# EAGLE design Pfeiffer_Compact_Gauge_Controller (EAGLE 8.5.2)
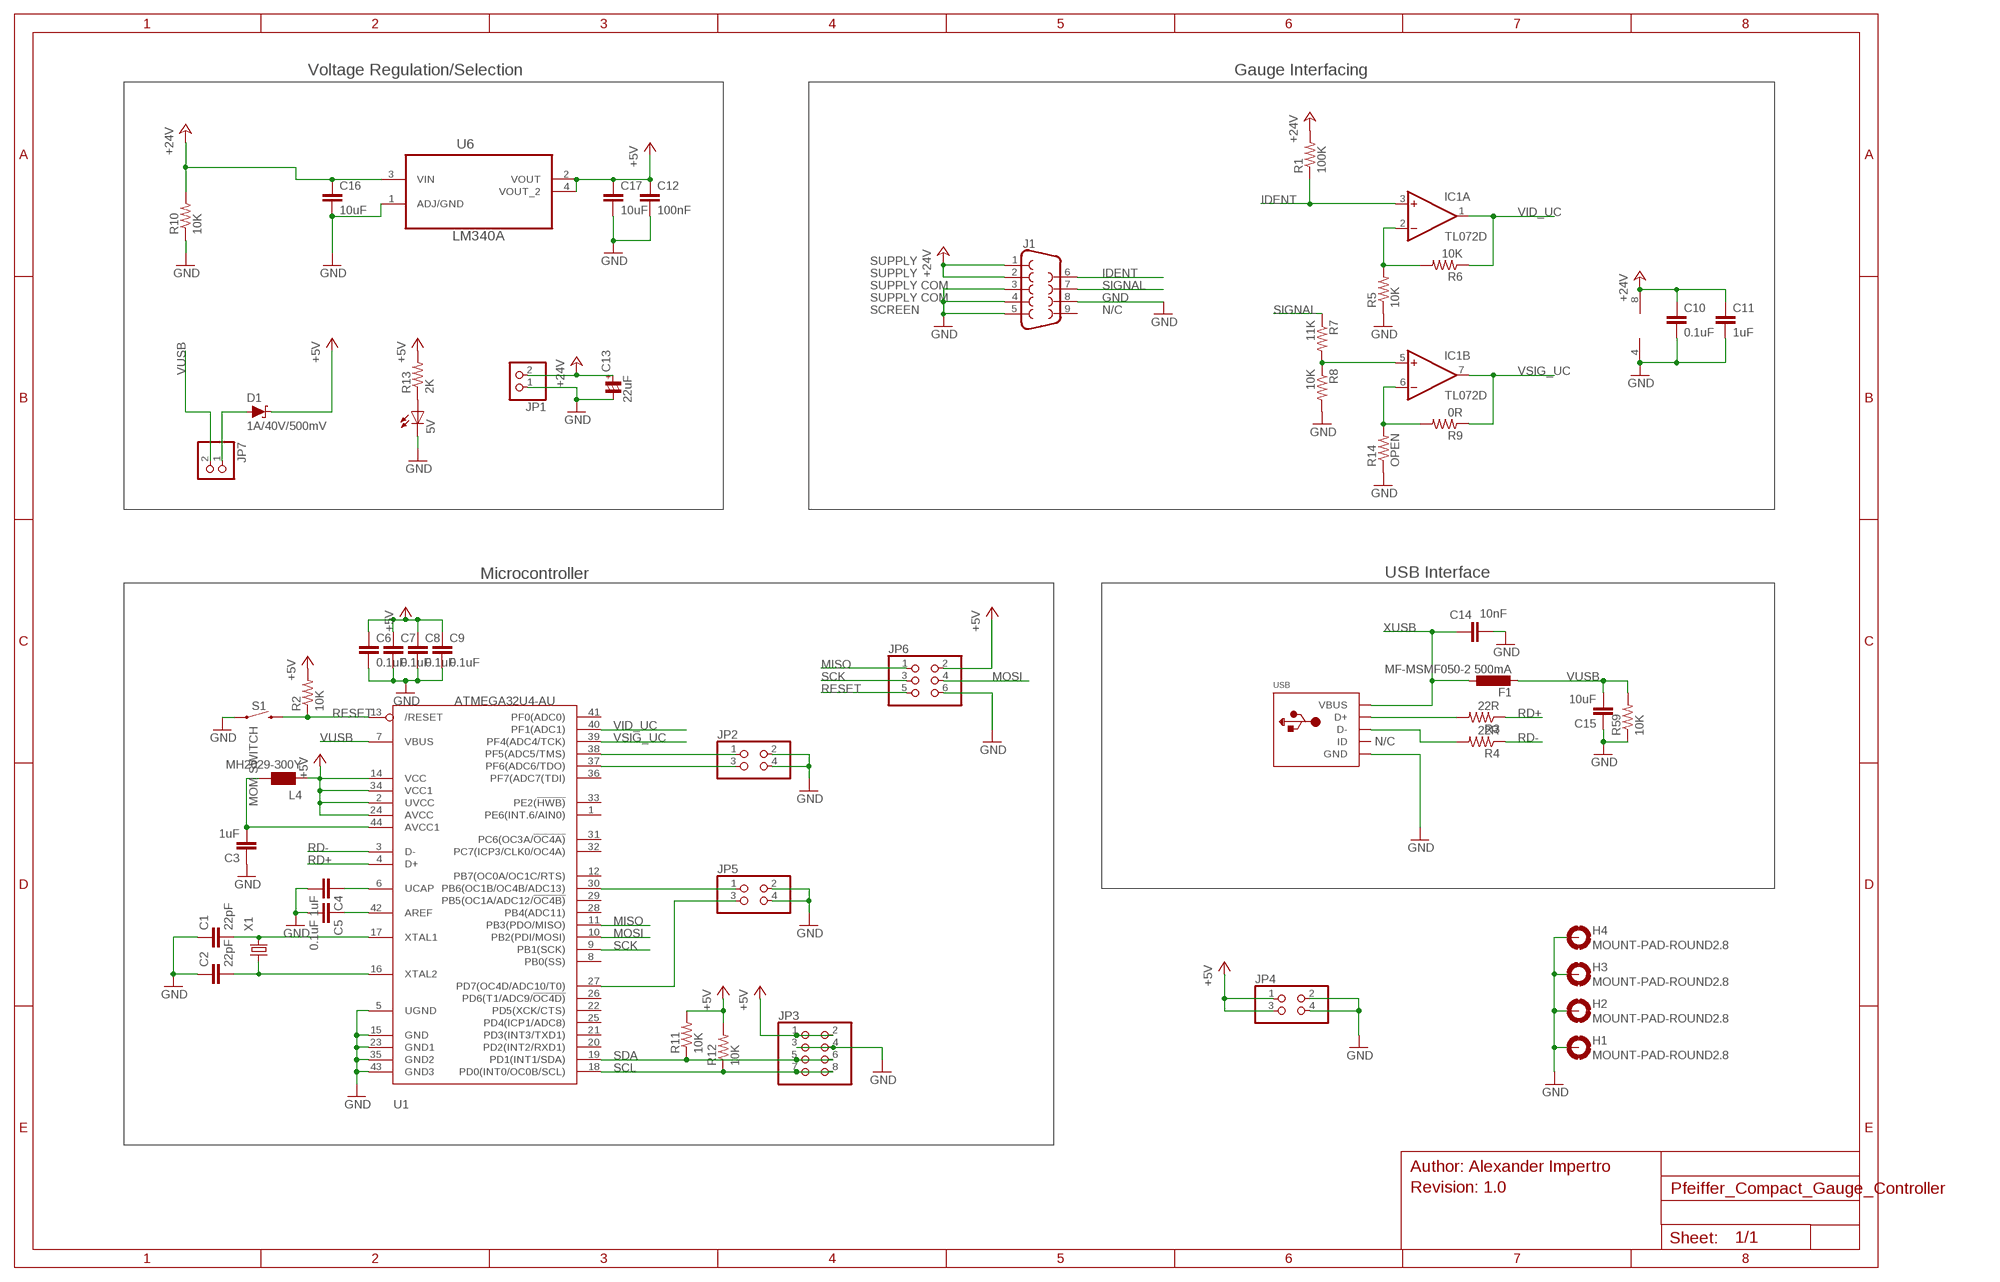
[diagram p0: schematic, sheet 1]

## Parts
5V  LEDCHIPLED_0805  [CHIPLED_0805]
C1  22pF  C-EUC0805  [C0805]
C2  22pF  C-EUC0805  [C0805]
C3  1uF  C-EUC0805  [C0805]
C4  1uF  C-EUC0805  [C0805]
C5  0.1uF  C-EUC0805  [C0805]
C6  0.1uF  C-EUC0805  [C0805]
C7  0.1uF  C-EUC0805  [C0805]
C8  0.1uF  C-EUC0805  [C0805]
C9  0.1uF  C-EUC0805  [C0805]
C10  0.1uF  C-EUC0805  [C0805]
C11  1uF  C-EUC0805  [C0805]
C12  100nF  C-EUC0805  [C0805]
C13  22uF  CP_SV-C  [CSV-C]
C14  10nF  C-EUC0805  [C0805]
C15  10uF  C-EUC0805  [C0805]
C16  10uF  C-EUC0805  [C0805]
C17  10uF  C-EUC0805  [C0805]
D1  1A/40V/500mV  DIODE-SCHOTTKY-SS14  [SMA-DIODE]
F1  MF-MSMF050-2 500mA  PROTEZIONE_0002_MF-MSMF050-2  [PROTEZIONE_L1812]
H1  MOUNT-PAD-ROUND2.8  [2,8-PAD]
H2  MOUNT-PAD-ROUND2.8  [2,8-PAD]
H3  MOUNT-PAD-ROUND2.8  [2,8-PAD]
H4  MOUNT-PAD-ROUND2.8  [2,8-PAD]
IC1  TL072D  [SO08]
J1  DB9MALE  [DB9_MALE]
JP1  PINHD-1X2/90  [1X02/90]
JP2  PINHD-2X2  [2X02]
JP3  PINHD-2X4  [2X04]
JP4  PINHD-2X2  [2X02]
JP5  PINHD-2X2  [2X02]
JP6  PINHD-2X3  [2X03]
JP7  PINHD-1X2  [1X02]
L4  MH2029-300Y  PROTEZIONE_0001_BLM21PG300SN1D_/_MH2029-300Y  [PROTEZIONE_0805]
R1  100K  R-US_R0805  [R0805]
R2  10K  R-US_R0805  [R0805]
R3  22R  R-US_R0805  [R0805]
R4  22R  R-US_R0805  [R0805]
R5  10K  R-US_R0805  [R0805]
R6  10K  R-US_R0805  [R0805]
R7  11K  R-US_R0805  [R0805]
R8  10K  R-US_R0805  [R0805]
R9  0R  R-US_R0805  [R0805]
R10  10K  R-US_R0805  [R0805]
R11  10K  R-US_R0805  [R0805]
R12  10K  R-US_R0805  [R0805]
R13  2K  R-US_R0805  [R0805]
R14  OPEN  R-US_R0805  [R0805]
R59  10K  R-US_R0805  [R0805]
S1  MOM SWITCH  MOMENTARY-SWITCH-SPST-SMD-5.2MM  [TACTILE_SWITCH_SMD_5.2MM]
U1  ATMEGA32U4-AU  [TQFP44]
U6  LM340A  LM1117IMP-5.0  [SOT230P696X180-4N]
USB  USBMINIB  [USB-MINIB]
X1  KX-7  [3.2X2.5_KX-7]

## Nets
+5V: C6.1 C7.1 C8.1 C9.1 C12.1 C17.1 D1.C JP3.1 JP3.2 JP4.1 JP4.3 JP6.2 L4.1 R2.2 R11.2 R12.2 R13.2 U1.2(UVCC) U1.14(VCC) U1.24(AVCC) U1.34(VCC1) U6.2(VOUT) U6.4(VOUT_2)
+24V: C10.1 C11.1 C13.+ C16.1 IC1.8(P:V+) J1.1 J1.2 JP1.2 R1.2 R10.2 U6.3(VIN)
GND: 5V.C C1.1 C2.1 C3.1 C4.2 C5.2 C6.2 C7.2 C8.2 C9.2 C10.2 C11.2 C12.2 C13.- C14.2 C15.1 C16.2 C17.2 H1.B2,8(MOUNT) H2.B2,8(MOUNT) H3.B2,8(MOUNT) H4.B2,8(MOUNT) IC1.4(P:V-) J1.3 J1.4 J1.5 J1.8 JP1.1 JP2.2 JP2.4 JP3.3 JP3.4 JP4.2 JP4.4 JP5.2 JP5.4 JP6.6 R5.1 R8.2 R10.1 R14.1 R59.1 S1.1 U1.5(UGND) U1.15(GND) U1.23(GND1) U1.35(GND2) U1.43(GND3) U6.1(ADJ/GND) USB.GND
IDENT: IC1.3(A:+IN) J1.6 R1.1
MISO: JP6.1 U1.11(PB3(PDO/MISO))
MOSI: JP6.4 U1.10(PB2(PDI/MOSI))
N$1: C1.2 U1.17(XTAL1) X1.3
N$2: C2.2 U1.16(XTAL2) X1.1
N$3: C3.2 L4.2 U1.44(AVCC1)
N$4: C4.1 U1.6(UCAP)
N$5: C5.1 U1.42(AREF)
N$6: R3.2 USB.D+
N$7: R4.2 USB.D-
N$8: IC1.2(A:-IN) R5.2 R6.2
N$9: IC1.6(B:-IN) R9.2 R14.2
N$10: IC1.5(B:+IN) R7.2 R8.1
N$11: JP2.1 U1.38(PF5(ADC5/TMS))
N$12: D1.A JP7.1
N$13: JP2.3 U1.37(PF6(ADC6/TDO))
N$14: JP5.1 U1.30(PB6(OC1B/OC4B/ADC13))
N$15: JP5.3 U1.27(PD7(OC4D/ADC10/T0))
N$16: 5V.A R13.1
RD+: R3.1 U1.4(D+)
RD-: R4.1 U1.3(D-)
RESET: JP6.5 R2.1 S1.3 U1.13(/RESET)
SCK: JP6.3 U1.9(PB1(SCK))
SCL: JP3.7 JP3.8 R12.1 U1.18(PD0(INT0/OC0B/SCL))
SDA: JP3.5 JP3.6 R11.1 U1.19(PD1(INT1/SDA))
SIGNAL: J1.7 R7.1
VID_UC: IC1.1(A:OUT) R6.1 U1.40(PF1(ADC1))
VSIG_UC: IC1.7(B:OUT) R9.1 U1.39(PF4(ADC4/TCK))
VUSB: C15.2 F1.2 JP7.2 R59.2 U1.7(VBUS)
XUSB: C14.1 F1.1 USB.VBUS
Unconnected: J1.9 U1.1(PE6(INT.6/AIN0)) U1.8(PB0(SS)) U1.12(PB7(OC0A/OC1C/RTS)) U1.20(PD2(INT2/RXD1)) U1.21(PD3(INT3/TXD1)) U1.22(PD5(XCK/CTS)) U1.25(PD4(ICP1/ADC8)) U1.26(PD6(T1/ADC9/!OC4D)) U1.28(PB4(ADC11)) U1.29(PB5(OC1A/ADC12/!OC4B)) U1.31(PC6(OC3A/!OC4A)) U1.32(PC7(ICP3/CLK0/OC4A)) U1.33(PE2(!HWB)) U1.36(PF7(ADC7(TDI)) U1.41(PF0(ADC0)) USB.ID

## Notes on the sheet
- Voltage Regulation/Selection | Gauge Interfacing
- SUPPLY
- SUPPLY
- SUPPLY COM
- SUPPLY COM
- SCREEN | N/C
- Microcontroller | USB Interface
- N/C
- Author: Alexander Impertro
- Revision: 1.0

## Library data of the parts
5V = led:LED: LED OSRAM: - CHIPLED LG R971, LG N971, LY N971, LG Q971, LY Q971, LO R971, LY R971 LH N974, LH R974 LS Q976, LO Q976, LY Q976 LO Q996 - Hyper CHIPLED LW Q18S LB Q993, LB Q99A, LB R99A - SideLED LS A670, LO A670, LY A670, LG A670, LP A670 LB A673, LV A673, LT A673, LW A673 LH A674 LY A675 LS A676, LA A676, LO A676, LY A676, LW A676 LS A679, LY A679, LG A679 - Hyper Micro SIDELED® LS Y876, LA Y876, LO Y876, LY Y876 LT Y87S - SmartLED LW L88C, LW L88S LB L89C, LB L89S, LG L890 LS L89K, LO L89K, LY L89K LS L896, LA L896, LO L896, LY L896 - TOPLED LS T670, LO T670, LY T670, LG T670, LP T670 LSG T670, LSP T670, LSY T670, LOP T670, LYG T670 LG T671, LOG T671, LSG T671 LB T673, LV T673, LT T673, LW T673 LH T674 LS T676, LA T676, LO T676, LY T676, LB T676, LH T676, LSB T676, LW T676 LB T67C, LV T67C, LT T67C, LS T67K, LO T67K, LY T67K, LW E67C LS E67B, LA E67B, LO E67B, LY E67B, LB E67C, LV E67C, LT E67C LW T67C LS T679, LY T679, LG T679 LS T770, LO T770, LY T770, LG T770, LP T770 LB T773, LV T773, LT T773, LW T773 LH T774 LS E675, LA E675, LY E675, LS T675 LS T776, LA T776, LO T776, LY T776, LB T776 LHGB T686 LT T68C, LB T68C - Hyper Mini TOPLED® LB M676 - Mini TOPLED Santana® LG M470 LS M47K, LO M47K, LY M47K Source: http://www.osram.convergy.de LUXEON: - LUMILED® LXK2-PW12-R00, LXK2-PW12-S00, LXK2-PW14-U00, LXK2-PW14-V00 LXK2-PM12-R00, LXK2-PM12-S00, LXK2-PM14-U00 LXK2-PE12-Q00, LXK2-PE12-R00, LXK2-PE12-S00, LXK2-PE14-T00, LXK2-PE14-U00 LXK2-PB12-K00, LXK2-PB12-L00, LXK2-PB12-M00, LXK2-PB14-N00, LXK2-PB14-P00, LXK2-PB14-Q00 LXK2-PR12-L00, LXK2-PR12-M00, LXK2-PR14-Q00, LXK2-PR14-R00 LXK2-PD12-Q00, LXK2-PD12-R00, LXK2-PD12-S00 LXK2-PH12-R00, LXK2-PH12-S00 LXK2-PL12-P00, LXK2-PL12-Q00, LXK2-PL12-R00 Source: www.luxeon.com KINGBRIGHT: KA-3528ASYC Source: www.kingbright.com
C1-C12 C14-C17 = rcl:C-EU: CAPACITOR, European symbol; SPICEPREFIX: C
C13 = rc-master-smd:CP_: POLARIZED CAP
D1 = SparkFun-DiscreteSemi:DIODE-SCHOTTKY: Schottky diode A Schottky diode is a semiconductor diode which has a low forward voltage drop and a very fast switching action.; PROD_ID: DIO-08053
F1 = Arduino-M0-V1:PROTEZIONE_0002_MF-MSMF050-2: 500 mA Multifuse ? Polyfuse; MONTHLY_USAGE: _____; PART_NUMBER: MF-MSMF050-2; PRICE: _____; SUPPLIER: _____; TYPE: Protezione
H1-H4 = holes:MOUNT-PAD-ROUND: MOUNTING PAD, round
IC1 = linear:TL072: OP AMP
J1 = SparkFun-Connectors:DB9: DB9 Connector Standard DB9 (D-Sub 9) serial connector. Can be used for CAN bus as well as RS485 and RS232. Footprint production proven. Here is the female version connector we sell at SparkFun: 9 Pin Female Serial Connector - PCB Mount <https://www.sparkfun.com/products/429> (PRT-00429) This connector has been used on the following SparkFun products: SparkFun RS232 Shifter - SMD <https://www.sparkfun.com/products/449> (PRT-00449) SparkFun RS232 Shifter SMD (No DB9) <https://www.sparkfun.com/products/8780> (PRT-08780); PROD_ID: CONN-09904
JP1 JP7 = pinhead:PINHD-1X2: PIN HEADER
JP2 JP4 JP5 = pinhead:PINHD-2X2: PIN HEADER
JP3 = pinhead:PINHD-2X4: PIN HEADER
JP6 = pinhead:PINHD-2X3: PIN HEADER
L4 = Arduino-M0-V1:PROTEZIONE_0001_BLM21PG300SN1D_/_MH2029-300Y: BLM21; MONTHLY_USAGE: _____; PART_NUMBER: BLM21PG300SN1D_/_MH2029-300Y; PRICE: _____; SUPPLIER: _____; TYPE: Protezione
R1-R14 R59 = rcl:R-US_: RESISTOR, American symbol; SPICEPREFIX: R
S1 = SparkFun-Switches:MOMENTARY-SWITCH-SPST: Momentary Switch (Pushbutton) - SPST Normally-open (NO) SPST momentary switches (buttons, pushbuttons). Variants PTH-12MM - 12mm square, through-hole Momentary Pushbutton Switch - 12mm Square <https://www.sparkfun.com/products/9190> (COM-09190) PTH-6.0MM, PTH-6.0MM-KIT - 6.0mm square, through-hole Mini Pushbutton Switch <https://www.sparkfun.com/products/97> (COM-00097) KIT package intended for soldering kit's - only one side of pads' copper is exposed. PTH-RIGHT-ANGLE-KIT - Right-angle, through-hole Right Angle Tactile Button <https://www.sparkfun.com/products/10791> - Used on SparkFun BigTime Watch Kit <https://www.sparkfun.com/products/11734> SMD-12MM - 12mm square, surface-mount Tactile Button - SMD (12mm) <https://www.sparkfun.com/products/12993> (COM-12993) Used on SparkFun PicoBoard <https://www.sparkfun.com/products/11888> SMD-4.5MM - 4.5mm Square Trackball Switch Used on SparkFun Blackberry Trackballer Breakout <https://www.sparkfun.com/products/13169> SMD-4.6MMX2.8MM - 4.60mm x 2.80mm, surface mount Used on SparkFun SAMD21 Mini Breakout <https://www.sparkfun.com/products/13664> SMD-5.2MM, SMD-5.2-REDUNDANT - 5.2mm square, surface-mount Mini Pushbutton Switch - SMD <https://www.sparkfun.com/products/8720> (COM-08720) Used on Arduino Pro Mini <https://www.sparkfun.com/products/11114> REDUNDANT package connects both switch circuits together SMD-6.0X3.5MM - 6.0 x 3.5mm, surface mount Momentary Reset Switch SMD <https://www.sparkfun.com/products/8229> (COM-08229) SMD-6.2MM-TALL - 6.2mm square, surface mount Tactile Button - SMD (6mm) <https://www.sparkfun.com/products/12992> Used on SparkFun Digital Sandbox <https://www.sparkfun.com/products/12651> SMD-RIGHT-ANGLE - Right-angle, surface mount Used on SparkFun Block for Intel® Edison - Arduino <https://www.sparkfun.com/products/13036>; PROD_ID: SWCH-08247; SF_SKU: COM-08720
U1 = adafruit:ATMEGA32U4: http://www.ladyada.net/library/eagle
U6 = NSC_By_element14_Batch_1.1:LM1117IMP-5.0: IC REG LDO 800MA 5.0V; MPN: LM1117IMP-5.0; OC_FARNELL: -; OC_NEWARK: 41K3451; PACKAGE: SOT-223; SUPPLIER: National Semiconductor
USB = adafruit:USB: USB Connectors USBMINIB - Surface Mount Female Mini-B USB Connector 4UConnector: 06564 By microbuilder.eu Thru-hole RA Female Mini-B USB Connector 4UConnector: 18732 By ladyada.net
X1 = crystal-geyer_V1_0:KX: Quartz Crystals (MHz) SMD: KX - Serie Model Size l/w/h [mm] Frequency Range Frequency Stability Temp. Range [°C] Load Capacitance AECQ 200 availabel Datasheet KX-4 KX-5 KX-6 KX-7 KX-9A KX-9B KX-12A KX-12B KX-13 KX-20 KX-K KX-KS 1.6/1.2/0.3 2.0/1.6/0.45 2.5/2.0/0.55 3.2/2.5/0.8 5.0/3.2/1.0 5.0/3.2/1.1 6.0/3.5/1.1 6.0/3.5/1.0 7.0/5.0 /1.3 11.6/5.5/1.6 12.3/4.5/4.2 12.3/4.5/3.2 24.0 ~ 80.0 MHz 16.0 ~ 80.0 MHz 12.0 ~ 80.0 MHz 8.0 ~ 60.0 MHz 7,68 ~ 300,0 MHz 8,0 ~ 50,0 MHz 8,0 ~ 150,0 MHz 8,0 ~ 50,0 MHz 6,0 ~ 160,0 MHz 3,579 ~ 25,0 MHz 3,579 ~ 70,0 MHz 3,579 ~ 70,0 MHz ±10 … ±50ppm ±10 … ±50ppm ±10 … ±50ppm ±10 … ±50ppm ±10 … ±50ppm ±10 … ±50ppm ±10 … ±50ppm ±10 … ±50ppm ±10 … ±50ppm ±50ppm ±10 … ±50ppm ±10 … ±50ppm (*) -40°C …+85°C (*) -40°C …+125°C (*) -40°C …+125°C (*) -40°C …+125°C (*) -40°C …+105°C (*) -40°C …+105°C (*) -40°C …+125°C (*) -40°C …+105°C (*) -40°C …+105°C (*) -40°C …+105°C (*) -40°C …+85°C (*) -40°C …+85°C 8, 8…16 8, 8…16 10, 8…16 12, 7…20 16, 10…20 16, 10…20 16, 10…20 16, 12…20 16, 12…20 16, 12…20 16, 12…30 16, 12…30 - yes yes yes - - - - - - - - KX-4.pdf <http://www.geyer-electronic.de/uploads/tx_userartikelfrequenz/GEYER-KX-4.pdf> KX-5.pdf <http://www.geyer-electronic.de/uploads/tx_userartikelfrequenz/GEYER-KX-5.pdf> KX-6.pdf <http://www.geyer-electronic.de/uploads/tx_userartikelfrequenz/GEYER-KX-6.pdf> KX-7.pdf <http://www.geyer-electronic.de/uploads/tx_userartikelfrequenz/GEYER-KX-7.pdf> KX-9A.pdf <http://www.geyer-electronic.de/uploads/tx_userartikelfrequenz/GEYER-KX-9A.pdf> KX-9B.pdf <http://www.geyer-electronic.de/uploads/tx_userartikelfrequenz/GEYER-KX-9B.pdf> KX-12A.pdf <http://www.geyer-electronic.de/uploads/tx_userartikelfrequenz/GEYER-KX-12A.pdf> KX-12B.pdf <http://www.geyer-electronic.de/uploads/tx_userartikelfrequenz/GEYER-KX-12B.pdf> KX-13.pdf <http://www.geyer-electronic.de/uploads/tx_userartikelfrequenz/GEYER-KX-13.pdf> KX-20.pdf <http://www.geyer-electronic.de/uploads/tx_userartikelfrequenz/GEYER-KX-20.pdf> KX-K.pdf <http://www.geyer-electronic.de/uploads/tx_userartikelfrequenz/GEYER-KX-K.pdf> KX-KS.pdf <http://www.geyer-electronic.de/uploads/tx_userartikelfrequenz/GEYER-KX-KS.pdf> <http://www.geyer-electronic.de/fileadmin/template/img/logo-geyer-electronic.png> Details see: http://www.geyer-electronic.de/Frequenz-Produkte.9.0.html Created 2016-06-07, Hans Locher 2016 (C) Geyer Quartz Technology KX4,KX5,KX6,KX7,KX9A,KX9B,KX12A,KX12B,KX13,KX20,KXK,KXKS;1612;2016;2520;3225;5032;6035;7050;11655;12345;1,6x1,2;2,0x1,6;2,5x2,0;3,2x2,5;5,0x3,2;6,0x3,5;7,0x5,0;11,6x5,5;12,3x4,5;12,3x4,5;1.6x1.2;2.0x1.6;2.5x2.0;3.2x2.5;5.0x3.2;6.0x3.5;7.0x5.0;11.6x5.5;12.3x4.5;12.3x4.5;

## Board
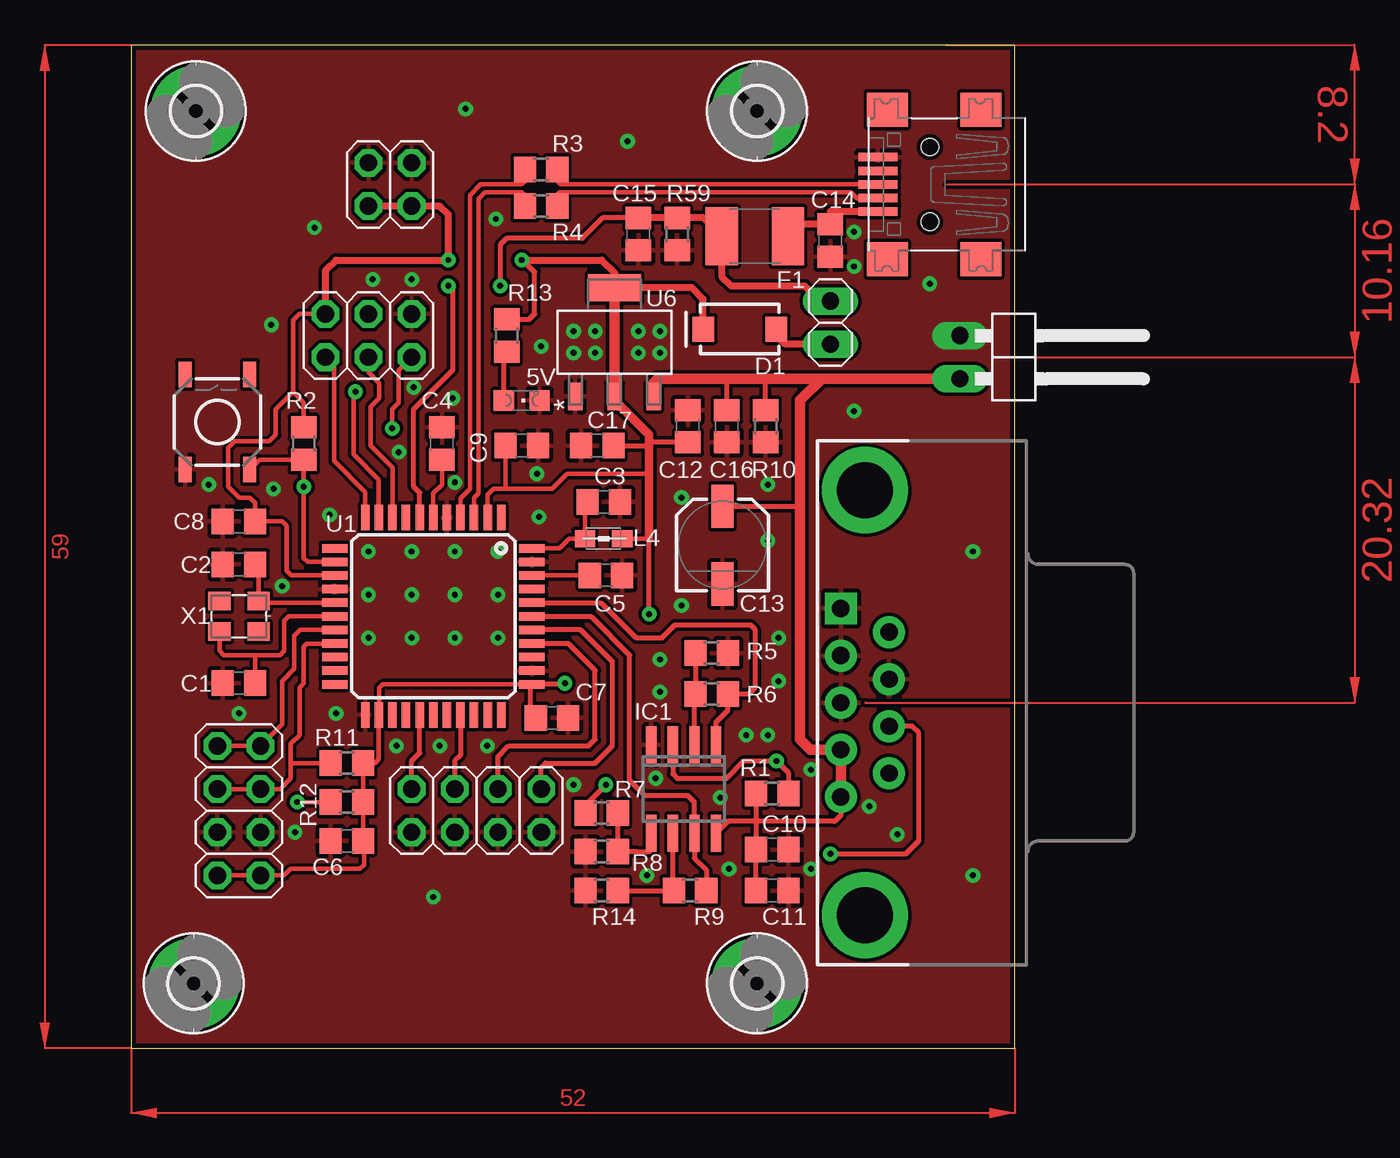
[diagram p1: board, top side]
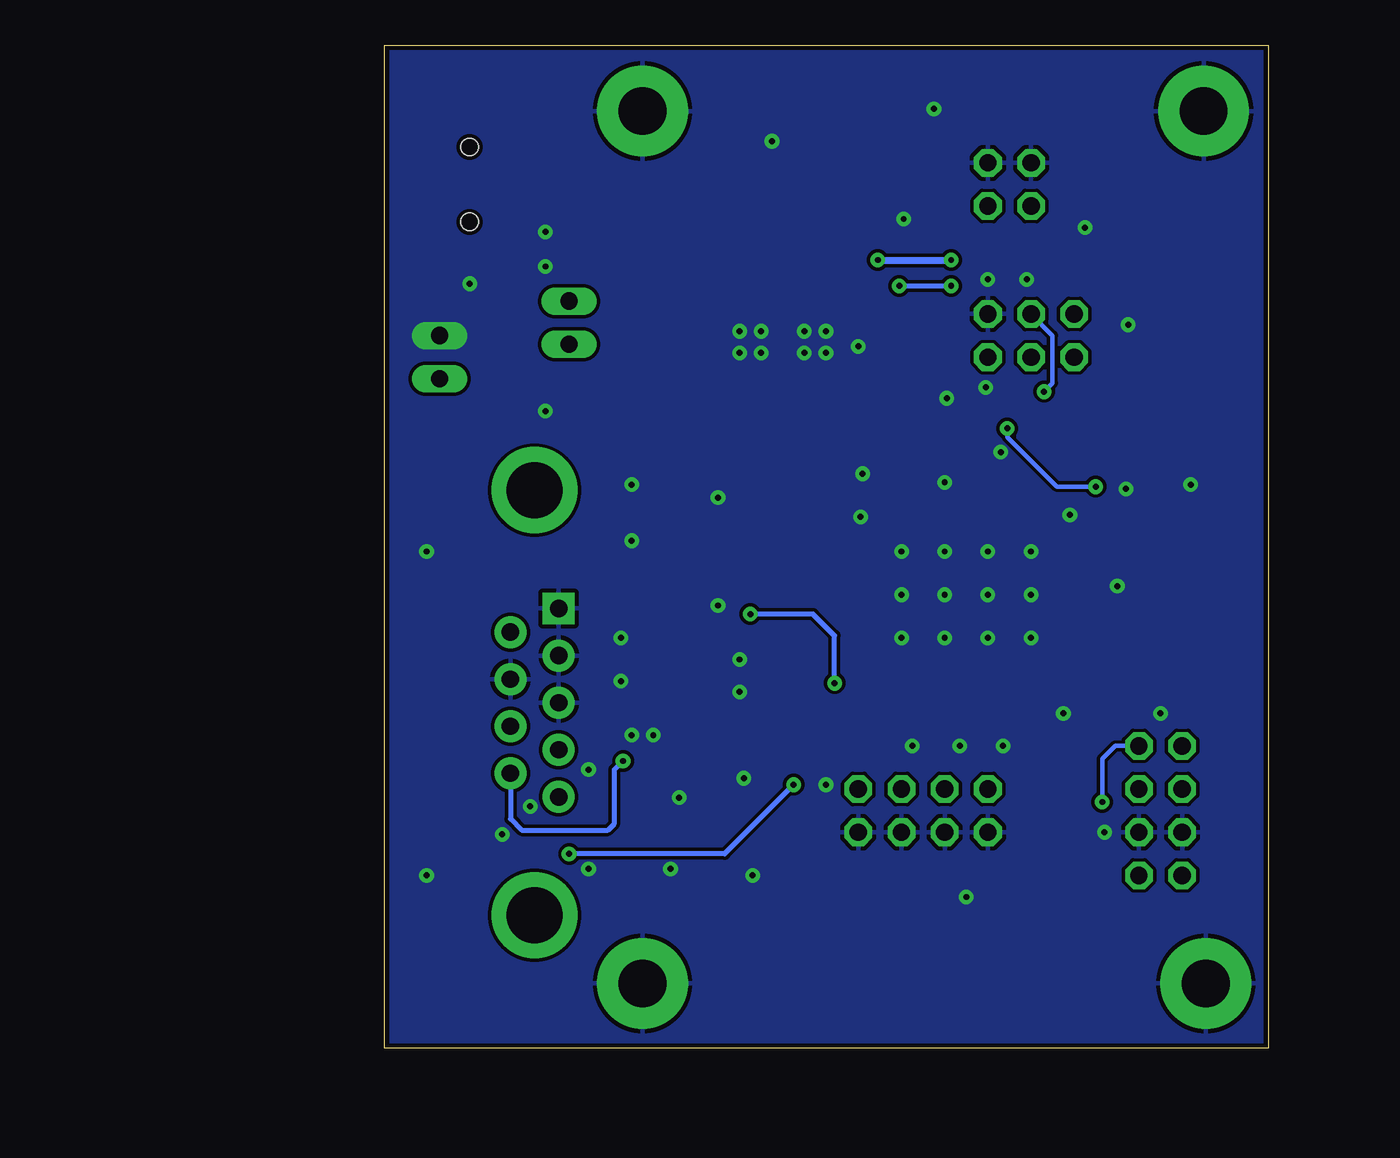
[diagram p2: board, bottom side, seen from below]

Size 52 x 59 mm. Coordinates in mm from the lower left corner, seen from the top.
Outline: 0,0 52,0 52,59 0,59 0,0
Copper layers (1*16): Top 0.035mm / dielectric 1.5mm / Bottom 0.035mm
Design rules "SparkFun": minimum track width 8mil, minimum drill 13mil, track to track 8mil, track to pad 8mil, pad to pad 8mil, via to via 8mil, smd to smd 8mil, copper to edge 10mil, drill to drill 8mil, minimum pad ring 12mil, minimum via ring 10mil, stop-mask expansion 4mil, vias tented up to drill 25mil, thermal gap 10mil

### Footprints (pad centres in the part's own frame; a part is rotated, then mirrored left to right if it is on the bottom)
CHIPLED_0805 = smd 1.2 x 1.2: A 0,-1.05; C 0,1.05
C0805 = smd 1.3 x 1.5: 1 -0.95,0; 2 0.95,0
CSV-C = smd 2.54 x 1.27: + -2.286,0; - 2.286,0
SMA-DIODE = smd 1.27 x 1.47: A -2.15,0; C 2.15,0
PROTEZIONE_L1812 = smd 1.9 x 3.4: 1 -1.95,0; 2 1.95,0
2,8-PAD = drill 2.8 pad 5.334: B2,8 0,0
SO08 = smd 0.6 x 2.2: 1 -1.905,-2.6; 2 -0.635,-2.6; 3 0.635,-2.6; 4 1.905,-2.6; 5 1.905,2.6; 6 0.635,2.6; 7 -0.635,2.6; 8 -1.905,2.6
DB9_MALE = drill 1.016 pad 1.88: 1 5.54,-1.42; 2 2.77,-1.42; 3 0,-1.42; 4 -2.77,-1.42; 6 4.15,1.42; 7 1.38,1.42; 8 -1.38,1.42; 9 -4.15,1.42 | drill 1.016 pad 1.88 square: 5 -5.54,-1.42 | drill 3.302 pad 5.08: G1 -12.5,0; G2 12.5,0
1X02/90 = drill 1.016 long: 1 -1.27,-3.81; 2 1.27,-3.81
2X02 = drill 1.016 octagon: 1 -1.27,-1.27; 2 -1.27,1.27; 3 1.27,-1.27; 4 1.27,1.27
2X04 = drill 1.016 octagon: 1 -3.81,-1.27; 2 -3.81,1.27; 3 -1.27,-1.27; 4 -1.27,1.27; 5 1.27,-1.27; 6 1.27,1.27; 7 3.81,-1.27; 8 3.81,1.27
2X03 = drill 1.016 octagon: 1 -2.54,-1.27; 2 -2.54,1.27; 3 0,-1.27; 4 0,1.27; 5 2.54,-1.27; 6 2.54,1.27
1X02 = drill 1.016 long: 1 -1.27,0; 2 1.27,0
PROTEZIONE_0805 = smd 1.2 x 1: 1 -1.1,0; 2 1.1,0
R0805 = smd 1.3 x 1.5: 1 -0.95,0; 2 0.95,0
TACTILE_SWITCH_SMD_5.2MM = smd 1.524 x 0.762: 1 -2.794,1.905; 2 2.794,1.905; 3 -2.794,-1.905; 4 2.794,-1.905
TQFP44 = smd 1.5 x 0.5: 1 -5.8,4; 2 -5.8,3.2; 3 -5.8,2.4; 4 -5.8,1.6; 5 -5.8,0.8; 6 -5.8,0; 7 -5.8,-0.8; 8 -5.8,-1.6; 9 -5.8,-2.4; 10 -5.8,-3.2; 11 -5.8,-4; 23 5.8,-4; 24 5.8,-3.2; 25 5.8,-2.4; 26 5.8,-1.6; 27 5.8,-0.8; 28 5.8,0; 29 5.8,0.8; 30 5.8,1.6; 31 5.8,2.4; 32 5.8,3.2; 33 5.8,4 | smd 0.5 x 1.5: 12 -4,-5.8; 13 -3.2,-5.8; 14 -2.4,-5.8; 15 -1.6,-5.8; 16 -0.8,-5.8; 17 0,-5.8; 18 0.8,-5.8; 19 1.6,-5.8; 20 2.4,-5.8; 21 3.2,-5.8; 22 4,-5.8; 34 4,5.8; 35 3.2,5.8; 36 2.4,5.8; 37 1.6,5.8; 38 0.8,5.8; 39 0,5.8; 40 -0.8,5.8; 41 -1.6,5.8; 42 -2.4,5.8; 43 -3.2,5.8; 44 -4,5.8
SOT230P696X180-4N = smd 1.6 x 0.838: 1 -3.2,2.311; 2 -3.2,0; 3 -3.2,-2.311 | smd 1.6 x 3.099: 4 3.2,0
USB-MINIB = smd 0.5 x 2.308: D+ 0,4.064; D- -0.8,4.064; GND 1.6,4.064; ID 0.8,4.064; VBUS -1.6,4.064 | smd 2 x 2.4: GND1 -4.4,-2; GND2 -4.4,3.5; GND3 4.4,3.5; GND4 4.4,-2 | hole 1: -2.2,1; 2.2,1
3.2X2.5_KX-7 = smd 1.3 x 1.1: 1 -1.15,-0.9; 2 1.15,-0.9; 3 1.15,0.9; 4 -1.15,0.9

### Placement (x,y rotation side)
5V  22.99,38.1 270 top
C1  6.35,21.46 0 top
C2  6.35,28.45 0 top
C3  27.81,32.13 180 top
C4  18.29,35.56 90 top
C5  27.94,27.81 0 top
C6  12.7,12.19 180 top
C7  24.77,19.43 0 top
C8  6.35,30.99 180 top
C9  22.99,35.43 0 top
C10  37.72,11.68 0 top
C11  37.72,9.27 0 top
C12  32.77,36.58 90 top
C13  34.8,29.59 270 top
C14  41.15,47.5 270 top
C15  29.84,47.88 90 top
C16  35.05,36.58 270 top
C17  27.43,35.43 180 top
D1  35.81,42.29 180 top
F1  36.7,47.75 180 top
H1  3.81,55.12 0 top
H2  3.68,3.81 0 top
H3  36.83,55.12 0 top
H4  36.83,3.81 0 top
IC1  32.51,15.24 180 top
J1  43.18,20.32 270 top
JP1  52.58,40.64 270 top
JP2  22.86,13.97 180 top
JP3  6.35,13.97 90 top
JP4  15.24,50.8 0 top
JP5  17.78,13.97 180 top
JP6  13.97,41.91 0 top
JP7  41.15,42.67 90 top
L4  27.81,29.97 180 top
R1  37.72,14.99 180 top
R2  10.16,35.56 90 top
R3  24.13,51.69 0 top
R4  24.13,49.53 0 top
R5  34.16,23.24 180 top
R6  34.16,20.83 180 top
R7  27.69,13.84 0 top
R8  27.69,11.56 180 top
R9  32.89,9.27 180 top
R10  37.34,36.58 90 top
R11  12.7,16.76 0 top
R12  12.7,14.48 0 top
R13  22.1,41.91 90 top
R14  27.69,9.27 0 top
R59  32.13,47.88 90 top
S1  5.08,36.83 90 top
U1  17.78,25.4 270 top
U6  28.45,41.53 90 top
USB  48.01,50.8 90 top
X1  6.35,25.4 180 top

### Tracks (layer width: path | path; a pad name or v marks a point on that pad's centre or on a via)
+5V  (via drill 0.35)
  Top 0.254: U1.14 9.41,27.8 9.14,28.07 9.14,30.73 8.89,30.99 C8.1 7.3,32.07 6.99,32.38 6.35,32.38 5.71,33.02 5.71,35.31 6.1,35.69 8.13,35.69 8.51,36.07 8.51,37.59 9.53,38.61 | JP6.2 9.91,43.18 9.53,42.8 9.53,38.61 | 30.48,33.78 25.65,33.78 24.77,32.89 21.97,32.89 | L4.1 30.48,29.97 | U1.34 23.5,21.4 14.8,21.4 14.61,21.21 14.61,19.62 U1.24 14.58,16.99 14.35,16.76 13.78,16.76 13.65,16.64 | 9.53,38.61 10.16,37.97 R2.2 | C6.1 13.72,12.19 | R11.2 13.65,16.64 | 13.65,16.64 R12.2 13.65,12.26 13.72,12.19 | JP3.2 JP3.1 9.02,10.16 9.4,10.54 13.46,10.54 13.72,10.79 13.72,12.19 | U1.2 20.98,32.54 21.34,32.89 21.97,32.89 | 23.01,46.38 v22.99,46.35 | C9.1 22.04,32.96 21.97,32.89
  Top 0.305: v30.48,25.53 30.48,29.97 | 28.42,41.5 28.45,41.53 | C12.1 30.61,35.63 30.54,35.56 30.48,35.43 C17.1 | U1.34 25.46,21.4 v25.53,21.46 | C7.1 23.5,20 23.5,21.4 | R13.2 23.43,42.86 23.75,43.18 23.75,45.64 23.01,46.38
  Top 0.406: JP6.2 11.43,45.72 12.06,46.35 v18.67,46.35 18.67,49.02 18.16,49.53 JP4.3 JP4.1 | v22.99,46.35 27.69,46.35 28.45,45.59 U6.4 32.99,44.73 33.66,44.06 D1.C
  Top 0.508: 30.48,29.97 30.48,33.78 30.48,35.43 30.48,36.07 28.73,37.82 U6.2 28.45,39.12
  Top 0.61: U6.2 28.45,41.53 U6.4
  Bottom 0.305: v25.53,21.46 25.53,24.26 26.8,25.53 v30.48,25.53
  Bottom 0.406: v22.99,46.35 v18.67,46.35
+24V
  Top 0.305: 34.48,13.27 34.42,13.34 IC1.8 35.11,13.34 36.77,13.34 | R10.2 37.34,39.37 | C11.1 C10.1 36.77,13.34 | J1.1 41.76,13.69 41.4,13.34 36.77,13.34 | R1.2 36.77,13.34 | C13.+ 39.37,31.88 | C16.1 35.05,39.37
  Top 0.61: J1.1 J1.2 39.98,17.55 39.37,18.16 39.37,31.88 39.37,38.1 40.64,39.37 | 40.64,39.37 JP1.2 | 40.64,39.37 37.34,39.37 35.05,39.37 30.99,39.37 30.73,39.12 30.76,39.09 U6.3
GND  (via drill 0.35)
  other vias: 8.38,32.89 17.78,8.89 13.97,29.21 16.51,29.21 19.05,29.21 21.59,29.21 21.59,26.67 21.59,24.13 19.05,24.13 16.51,24.13 13.97,24.13 13.97,26.67 16.51,26.67 19.05,26.67 12.06,19.68 6.35,19.68 8.89,27.18 11.68,31.37 15.75,35.05 19.05,33.27 18.92,38.23 16.64,38.86 4.57,33.15 8.26,42.55 15.62,17.78 18.16,17.78 20.95,17.78 9.65,12.7 30.35,10.16 35.18,10.54 34.67,14.73 30.86,15.88 26.04,15.49 40.01,10.54 43.43,14.22 45.09,12.57 40.01,16.38 37.47,18.41 36.2,18.41 38.1,21.59 38.1,24.13 31.11,20.95 31.11,22.86 32.38,26.04 37.47,29.84 32.38,32.38 49.53,29.21 49.53,10.16 42.55,37.47 37.47,33.15 24,31.24 23.88,33.78 24.13,41.27 26.04,40.89 26.04,42.16 27.3,42.16 27.3,40.89 29.84,42.16 31.11,42.16 29.84,40.89 42.55,48.01 42.55,45.97 46.99,44.96 29.21,53.34 21.46,48.77 14.22,45.21 16.51,45.21 10.79,48.26 19.68,55.24 31.11,40.89
  pour Top (rank 6): -11.43,60.96 59.69,60.96 59.69,-2.54 -11.43,-2.54
  pour Bottom: -13.97,64.77 59.69,64.77 59.69,-5.08 -13.97,-5.08
  pour Top (no thermals): 46.99,43.18 50.8,43.18 50.8,40.64 46.99,40.64
  pour Bottom (no thermals): 46.99,43.18 50.8,43.18 50.8,40.64 46.99,40.64
IDENT  (via drill 0.35)
  Top 0.305: IC1.3 31.88,16.13 32.13,15.88 35.05,15.88 36.07,16.89 v37.97,16.89 | v37.97,16.89 38.23,16.64 38.41,16.45 | v37.97,16.89 38.67,16.2 R1.1
  Bottom 0.305: J1.6 44.6,13.48 43.94,12.83 38.86,12.83 38.48,13.21 38.48,16.38 v37.97,16.89
MISO
  Top 0.254: U1.11 13.78,32.7 11.94,34.54 11.94,40.13 JP6.1
MOSI  (via drill 0.35)
  Top 0.254: U1.10 14.58,33.43 13.08,34.92 13.08,38.48 v13.21,38.61
  Bottom 0.254: v13.21,38.61 12.7,39.12 12.7,41.91 JP6.4
N$1
  Top 0.254: X1.3 5.2,23.38 5.46,23.11 7.24,23.11 | C1.2 7.3,23.05 7.24,23.11 | 7.24,23.11 8.76,23.11 9.02,23.37 9.02,25.15 9.27,25.4 U1.17
N$2
  Top 0.254: U1.16 7.6,26.2 X1.1 7.5,28.76 C2.2
N$3
  Top 0.254: U1.44 25.21,29.4 25.78,29.97 L4.2 26.71,31.98 C3.2
N$4
  Top 0.254: U1.6 17.78,32.64 18.29,33.15 C4.1
N$5
  Top 0.254: U1.42 26.98,27.8 C5.1
N$6
  Top 0.254: R3.2 25.08,50.99 25.27,50.8 USB.D+
N$7
  Top 0.254: USB.D- 42.71,50 42.37,50.34 25.2,50.34 25.08,50.23 R4.2
N$8
  Top 0.305: R5.2 R6.2 33.15,20.76 IC1.2
N$9
  Top 0.305: IC1.6 31.88,9.4 31.94,9.21 R9.2 R14.2
N$10
  Top 0.305: R7.2 R8.1 29.21,11.56 29.72,11.56 30.48,11.56 30.61,11.68 30.54,11.75 30.54,12.57 IC1.5
N$11
  Top 0.305: JP2.1 24.13,16.51 24.38,16.76 27.3,16.76 28.32,17.78 28.32,22.73 26.45,24.6 U1.38
N$12
  Top 0.406: JP7.1 38.48,41.4 37.96,41.92 D1.A
N$13
  Top 0.305: JP2.3 21.59,17.14 22.23,17.78 26.92,17.78 27.3,18.16 27.3,22.23 25.73,23.8 U1.37
N$14
  Top 0.305: JP5.1 19.05,16.89 19.38,17.22 U1.30
N$15
  Top 0.305: JP5.3 16.51,16.89 16.98,17.36 U1.27
N$16
  Top 0.305: 5V.A 21.94,40.8 R13.1
RD+
  Top 0.254: U1.4 19.38,32.33 19.94,32.89 19.94,50.16 20.57,50.8 22.99,50.8 23.18,50.99 R3.1
RD-
  Top 0.254: U1.3 20.18,32.37 20.45,32.64 20.45,49.96 20.83,50.34 22.99,50.34 23.18,50.15 R4.1
RESET  (via drill 0.35)
  Top 0.254: U1.13 10.39,28.6 10.16,28.83 v10.16,33.02 R2.1 7.56,34.61 S1.3 | v15.37,36.45 15.37,37.59 15.75,37.97 15.75,39.88 JP6.5
  Bottom 0.254: v10.16,33.02 12.45,33.02 15.37,35.94 v15.37,36.45
SCK
  Top 0.254: U1.9 15.38,34.15 14.1,35.43 14.1,37.72 14.61,38.23 14.61,39.12 13.97,39.75 JP6.3
SCL  (via drill 0.35)
  Top 0.254: U1.18 9.94,24.6 9.6,24.26 9.6,22.3 8.89,21.59 8.89,19.05 JP3.7 JP3.8 | R12.1 v9.78,14.48
  Bottom 0.254: v9.78,14.48 9.78,17.02 9.02,17.78 JP3.7
SDA
  Top 0.254: U1.19 10.34,23.8 10.16,23.62 10.16,21.46 9.91,21.21 9.91,18.41 9.4,17.91 9.4,16.76 | JP3.6 JP3.5 8.76,15.24 9.4,15.88 9.4,16.76 | R11.1 9.4,16.76
SIGNAL  (via drill 0.35)
  Top 0.305: 28.07,15.24 v27.94,15.49 26.74,14.29 R7.1 | v41.15,11.43 45.59,11.43 46.35,12.19 46.35,18.54 45.96,18.94 J1.7
  Bottom 0.305: v27.94,15.49 32,11.43 v41.15,11.43
VID_UC
  Top 0.305: U1.40 23.62,26.16 27.69,26.16 29.72,24.13 31.24,24.13 32,24.89 36.45,24.89 36.7,24.64 36.7,21.21 36.32,20.83 R6.1 35.11,19.87 34.42,19.18 IC1.1
VSIG_UC
  Top 0.305: U1.39 27.05,25.4 29.34,23.11 29.34,15.75 30.23,14.86 32.77,14.86 33.15,14.48 IC1.7 33.15,11.18 33.84,10.48 R9.1
VUSB  (via drill 0.35)
  Top 0.305: C15.2 27.75,48.83 26.54,47.62 22.1,47.62 21.72,47.24 v21.72,44.83 | U1.7 16.98,32.68 16.64,33.02 16.64,37.59 18.92,39.88 18.92,44.58 v18.67,44.83
  Top 0.406: JP7.2 40.51,43.94 39.62,44.83 35.31,44.83 34.75,45.38 F1.2 33.68,48.83 R59.2 C15.2
  Bottom 0.305: v21.72,44.83 v18.67,44.83
XUSB
  Top 0.406: USB.VBUS 41.15,49.2 C14.1 39.56,48.45 38.86,47.75 F1.1
(copper drawn outside any net)
  shapes: Top area x5

### Text on the board
Document: J1
tDocu: +5V | ICSP | GND | +24V | PWR IN | SCL | D0 | D1 | A0 | A1 | SDA | GND | 5V | DIG | ANA | I2C | GAUGE | Pfeiffer Compact Gauge / Readout Circuit | A. Impertro, Rev 1.0, 2018